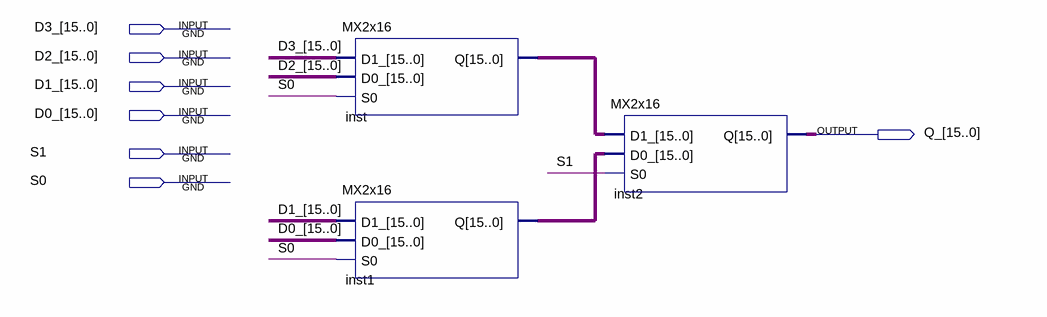
[diagram p0: schematic sheet]
// Quartus schematic MX4x16.bdf as structural Verilog: 3 symbols, 7 pins
module MX4x16 (
  input  [15:0] D3_,
  input  [15:0] D2_,
  input  [15:0] D1_,
  input  [15:0] D0_,
  input  S1,
  input  S0,
  output [15:0] Q_
);

  wire [15:0] inst1_q, inst_q;

  MX2x16 inst (.D1_(D3_), .D0_(D2_), .S0(S0), .Q(inst_q));
  MX2x16 inst1 (.D1_(D1_), .D0_(D0_), .S0(S0), .Q(inst1_q));
  MX2x16 inst2 (.D1_(inst_q), .D0_(inst1_q), .S0(S1), .Q(Q_));
endmodule
